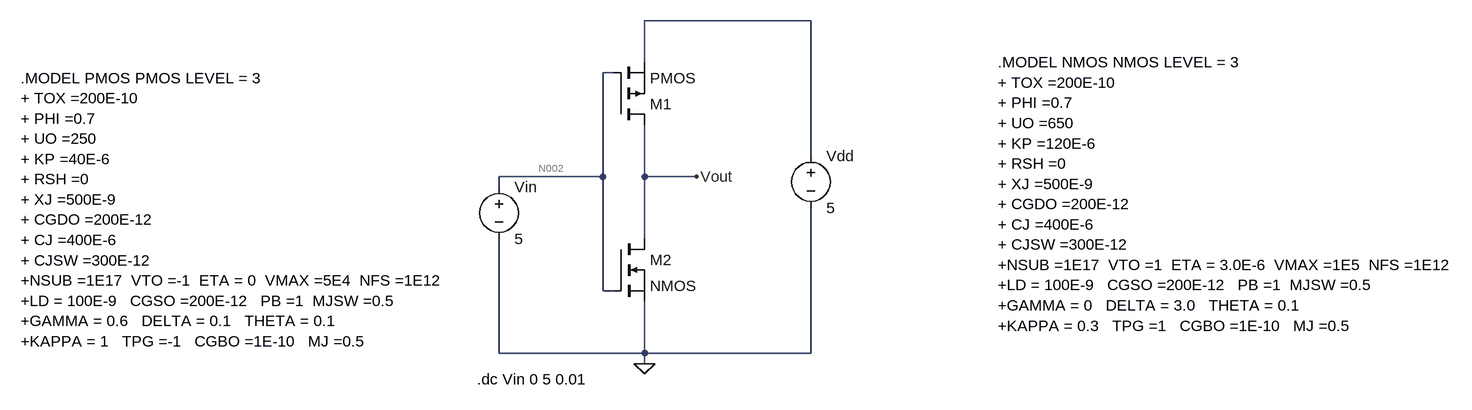
[diagram p0: schematic 1. zadatak.asc]
1. zadatak.asc, the LTspice schematic file:
Version 4
SHEET 1 1628 680
WIRE 608 -80 352 -80
WIRE 352 -16 352 -80
WIRE 304 0 288 0
WIRE 608 128 608 -80
WIRE 288 160 288 0
WIRE 288 160 128 160
WIRE 352 160 352 80
WIRE 432 160 352 160
WIRE 128 176 128 160
WIRE 352 256 352 160
WIRE 288 336 288 160
WIRE 304 336 288 336
WIRE 128 432 128 256
WIRE 352 432 352 352
WIRE 352 432 128 432
WIRE 608 432 608 208
WIRE 608 432 352 432
WIRE 352 448 352 432
FLAG 432 160 Vout
FLAG 352 448 0
SYMBOL voltage 128 160 R0
WINDOW 123 0 0 Left 0
WINDOW 39 0 0 Left 0
SYMATTR InstName Vin
SYMATTR Value 5
SYMBOL pmos 304 80 M180
SYMATTR InstName M1
SYMBOL nmos 304 256 R0
SYMATTR InstName M2
SYMBOL voltage 608 112 R0
SYMATTR InstName Vdd
SYMATTR Value 5
TEXT 94 472 Left 2 !.dc Vin 0 5 0.01
TEXT 896 -16 Left 2 !.MODEL NMOS NMOS LEVEL = 3\n+ TOX =200E-10\n+ PHI =0.7\n+ UO =650\n+ KP =120E-6\n+ RSH =0\n+ XJ =500E-9\n+ CGDO =200E-12\n+ CJ =400E-6\n+ CJSW =300E-12\n+NSUB =1E17  VTO =1  ETA = 3.0E-6  VMAX =1E5  NFS =1E12\n+LD = 100E-9   CGSO =200E-12   PB =1  MJSW =0.5\n+GAMMA = 0   DELTA = 3.0   THETA = 0.1\n+KAPPA = 0.3   TPG =1   CGBO =1E-10   MJ =0.5
TEXT -608 8 Left 2 !.MODEL PMOS PMOS LEVEL = 3\n+ TOX =200E-10\n+ PHI =0.7\n+ UO =250\n+ KP =40E-6\n+ RSH =0\n+ XJ =500E-9\n+ CGDO =200E-12\n+ CJ =400E-6\n+ CJSW =300E-12\n+NSUB =1E17  VTO =-1  ETA = 0  VMAX =5E4  NFS =1E12\n+LD = 100E-9   CGSO =200E-12   PB =1  MJSW =0.5\n+GAMMA = 0.6   DELTA = 0.1   THETA = 0.1\n+KAPPA = 1   TPG =-1   CGBO =1E-10   MJ =0.5

The netlist it stands for:
* 1. zadatak.asc
Vin N002 0 5
M1 Vout N002 N001 N001 PMOS
M2 Vout N002 0 0 NMOS
Vdd N001 0 5
.model NMOS NMOS
.model PMOS PMOS
.lib standard.mos
.dc Vin 0 5 0.01
.MODEL NMOS NMOS LEVEL = 3
+ TOX =200E-10
+ PHI =0.7
+ UO =650
+ KP =120E-6
+ RSH =0
+ XJ =500E-9
+ CGDO =200E-12
+ CJ =400E-6
+ CJSW =300E-12
+NSUB =1E17  VTO =1  ETA = 3.0E-6  VMAX =1E5  NFS =1E12
+LD = 100E-9   CGSO =200E-12   PB =1  MJSW =0.5
+GAMMA = 0   DELTA = 3.0   THETA = 0.1
+KAPPA = 0.3   TPG =1   CGBO =1E-10   MJ =0.5
.MODEL PMOS PMOS LEVEL = 3
+ TOX =200E-10
+ PHI =0.7
+ UO =250
+ KP =40E-6
+ RSH =0
+ XJ =500E-9
+ CGDO =200E-12
+ CJ =400E-6
+ CJSW =300E-12
+NSUB =1E17  VTO =-1  ETA = 0  VMAX =5E4  NFS =1E12
+LD = 100E-9   CGSO =200E-12   PB =1  MJSW =0.5
+GAMMA = 0.6   DELTA = 0.1   THETA = 0.1
+KAPPA = 1   TPG =-1   CGBO =1E-10   MJ =0.5
.backanno
.end

* Results of the author's LTspice run, read from the files saved beside the schematic
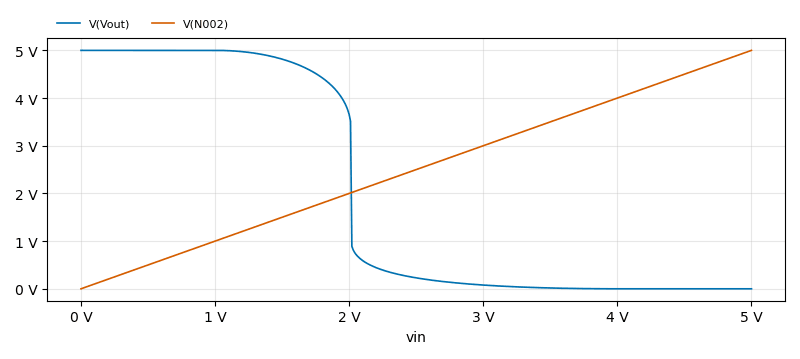
[diagram p1: DC transfer characteristic of 1. zadatak.asc, plotted from the saved traces]
* DC transfer characteristic, 1 run:
*   V(Vout): 5 V at vin=0 V, 29.15 nV at vin=5 V, min 29.15 nV, max 5 V
*   V(N002): 0 V at vin=0 V, 5 V at vin=5 V, min 0 V, max 5 V